# EAGLE design bandswitch (EAGLE 9.6.2)
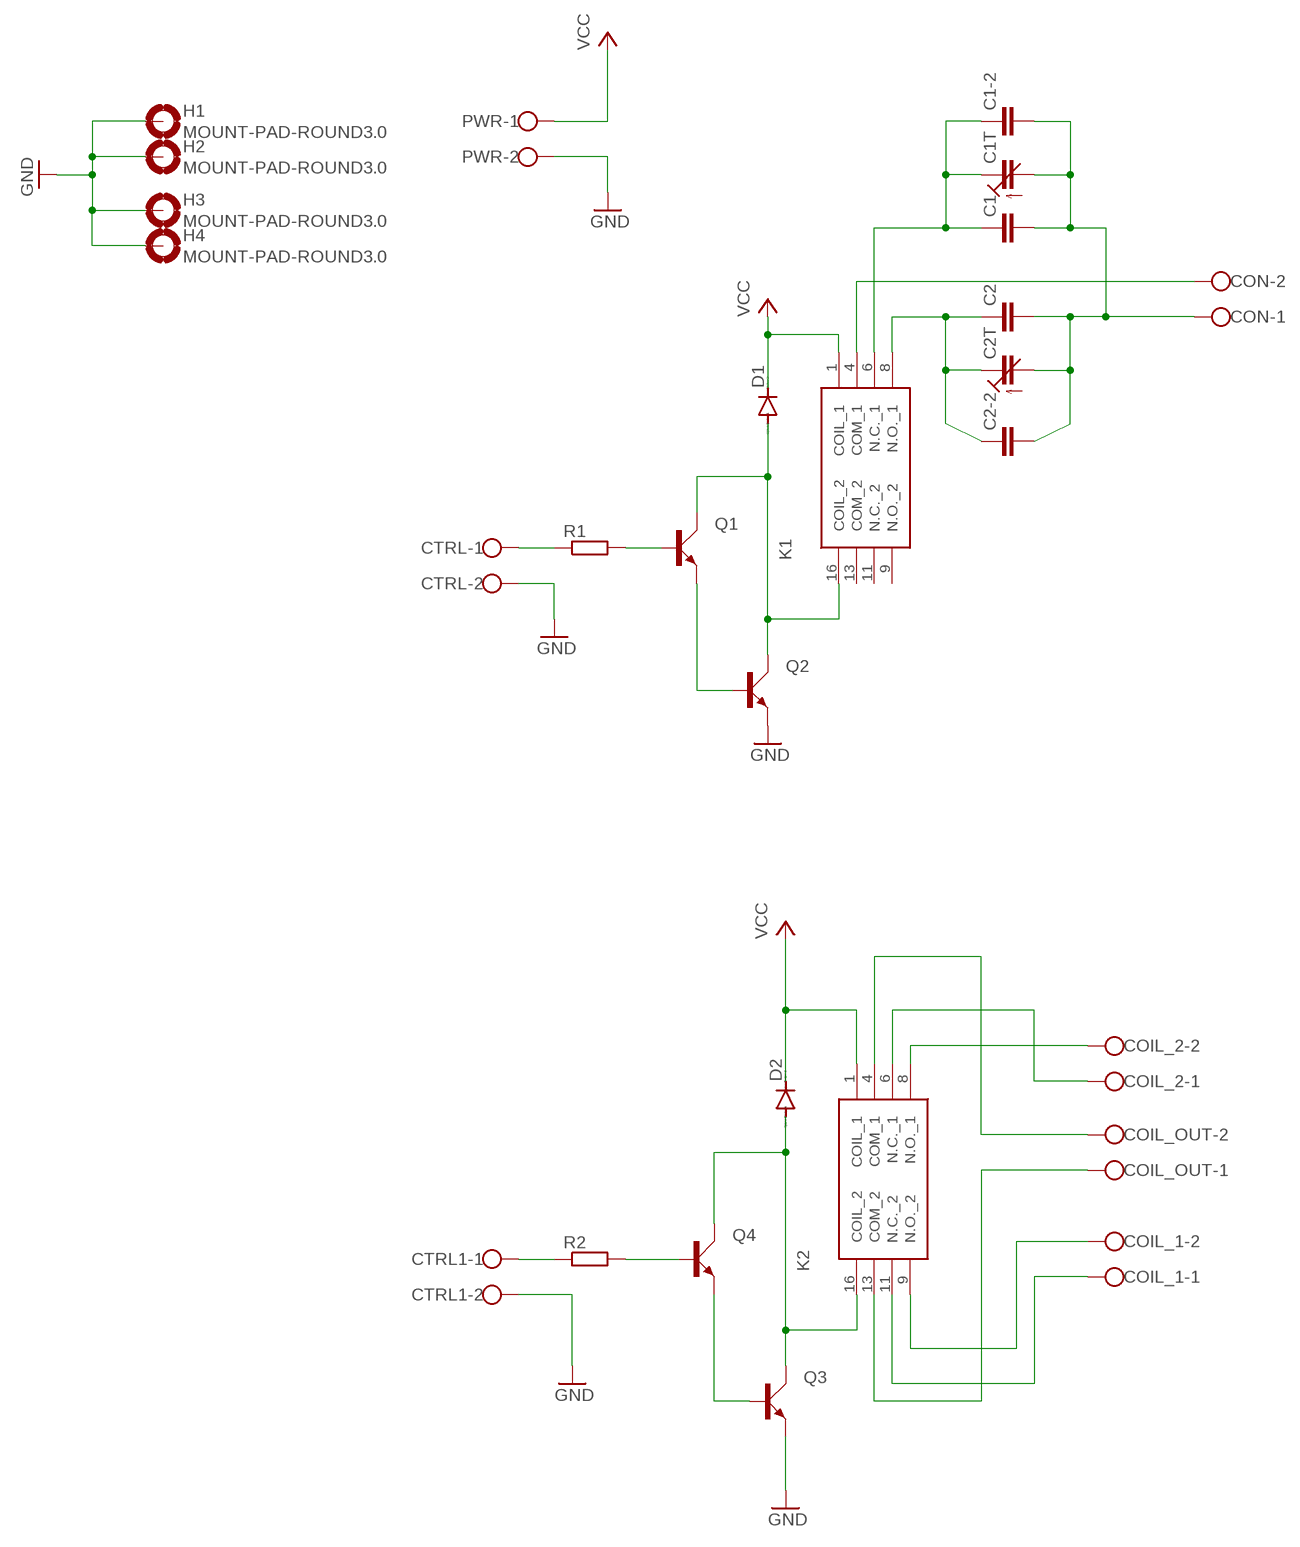
[diagram p0: schematic, sheet 1]

## Parts
C1  C_0805_PTH  [C0805K]
C1-2  C_0805_PTH  [C0805K]
C1T  C_TRIM_TH  [CTRIM3050.505]
C2  C_0805_PTH  [C0805K]
C2-2  C_0805_PTH  [C0805K]
C2T  C_TRIM_TH  [CTRIM3050.505]
COIL_1  W237-102  [W237-102]
COIL_2  W237-102  [W237-102]
COIL_OUT  W237-102  [W237-102]
CON  W237-102  [W237-102]
CTRL  W237-102  [W237-102]
CTRL1  W237-102  [W237-102]
D1  1N4148DO35-7  [DO35-7]
D2  1N4148DO35-7  [DO35-7]
H1  MOUNT-PAD-ROUND3.0  [3,0-PAD]
H2  MOUNT-PAD-ROUND3.0  [3,0-PAD]
H3  MOUNT-PAD-ROUND3.0  [3,0-PAD]
H4  MOUNT-PAD-ROUND3.0  [3,0-PAD]
K1  G5V-2-H1-DC5  [G5V2H1DC5]
K2  G5V-2-H1-DC5  [G5V2H1DC5]
PWR  W237-102  [W237-102]
Q1  BC547  [SOT54A]
Q2  BC547  [SOT54A]
Q3  BC547  [SOT54A]
Q4  BC547  [SOT54A]
R1  R_0805_PTH  [R0805]
R2  R_0805_PTH  [R0805]

## Nets
GND: CTRL1.2 CTRL.2 H1.B3,0(MOUNT) H2.B3,0(MOUNT) H3.B3,0(MOUNT) H4.B3,0(MOUNT) PWR.2 Q2.E Q3.E
N$1: Q1.E Q2.B
N$2: D1.A K1.16(COIL_2) Q1.C Q2.C
N$3: Q1.B R1.2 R1.P$2
N$4: CTRL.1 R1.1 R1.P$1
N$5: D2.A K2.16(COIL_2) Q3.C Q4.C
N$6: Q3.B Q4.E
N$7: Q4.B R2.2 R2.P$2
N$8: CTRL1.1 R2.1 R2.P$1
N$9: COIL_OUT.2 K2.4(COM_1)
N$10: C1-2.1 C1-2.P$1 C1.1 C1.P$1 C1T.2(E) K1.6(N.C._1)
N$11: C2-2.1 C2-2.P$1 C2.1 C2.P$1 C2T.2(E) K1.8(N.O._1)
N$12: C1-2.2 C1-2.P$2 C1.2 C1.P$2 C1T.1(A) C2-2.2 C2-2.P$2 C2.2 C2.P$2 C2T.1(A) CON.1
N$13: CON.2 K1.4(COM_1)
N$14: COIL_OUT.1 K2.13(COM_2)
N$15: COIL_1.1 K2.11(N.C._2)
N$16: COIL_2.1 K2.6(N.C._1)
N$17: COIL_2.2 K2.8(N.O._1)
N$18: COIL_1.2 K2.9(N.O._2)
VCC: D1.C D2.C K1.1(COIL_1) K2.1(COIL_1) PWR.1
Unconnected: K1.9(N.O._2) K1.11(N.C._2) K1.13(COM_2)

## Library data of the parts
C1 C1-2 C2 C2-2 = mylib:C_0805_PTH
C1T C2T = mylib:C_TRIM_TH
COIL_1 COIL_2 COIL_OUT CON CTRL CTRL1 PWR = con-wago-500:W237-102: WAGO SCREW CLAMP; MPN: 237-102; OC_FARNELL: unknown; OC_NEWARK: 70K9898
D1 D2 = diode:1N4148: DIODE high speed (Philips)
H1-H4 = holes:MOUNT-PAD-ROUND: MOUNTING PAD, round
K1 K2 = G5V-2-H1-DC5:G5V-2-H1-DC5: DPDT PCB Mount Non-Latching Relay Plug In, 1 A, 5V dc Source: Datasheet <http://uk.rs-online.com/web/p/products/8074535>; ARROW_PART_NUMBER: G5V-2-H1-DC5; ARROW_PRICE-STOCK: https://www.arrow.com/en/products/g5v-2-h1dc5/omron?region=nac; DESCRIPTION: DPDT PCB Mount Non-Latching Relay Plug In, 1 A, 5V dc; HEIGHT: 11.5mm; MANUFACTURER_NAME: Omron Electronics; MANUFACTURER_PART_NUMBER: G5V-2-H1-DC5; MOUSER_PART_NUMBER: 653-G5V-2-H1-DC5; MOUSER_PRICE-STOCK: https://www.mouser.co.uk/ProductDetail/Omron-Electronics/G5V-2-H1-DC5?qs=B3tblJ0Nlt9vPpFeBhhwGQ%3D%3D
Q1-Q4 = transistor-small-signal:BC547: NPN TRANSISTOR
R1 R2 = mylib:R_0805_PTH

## Board
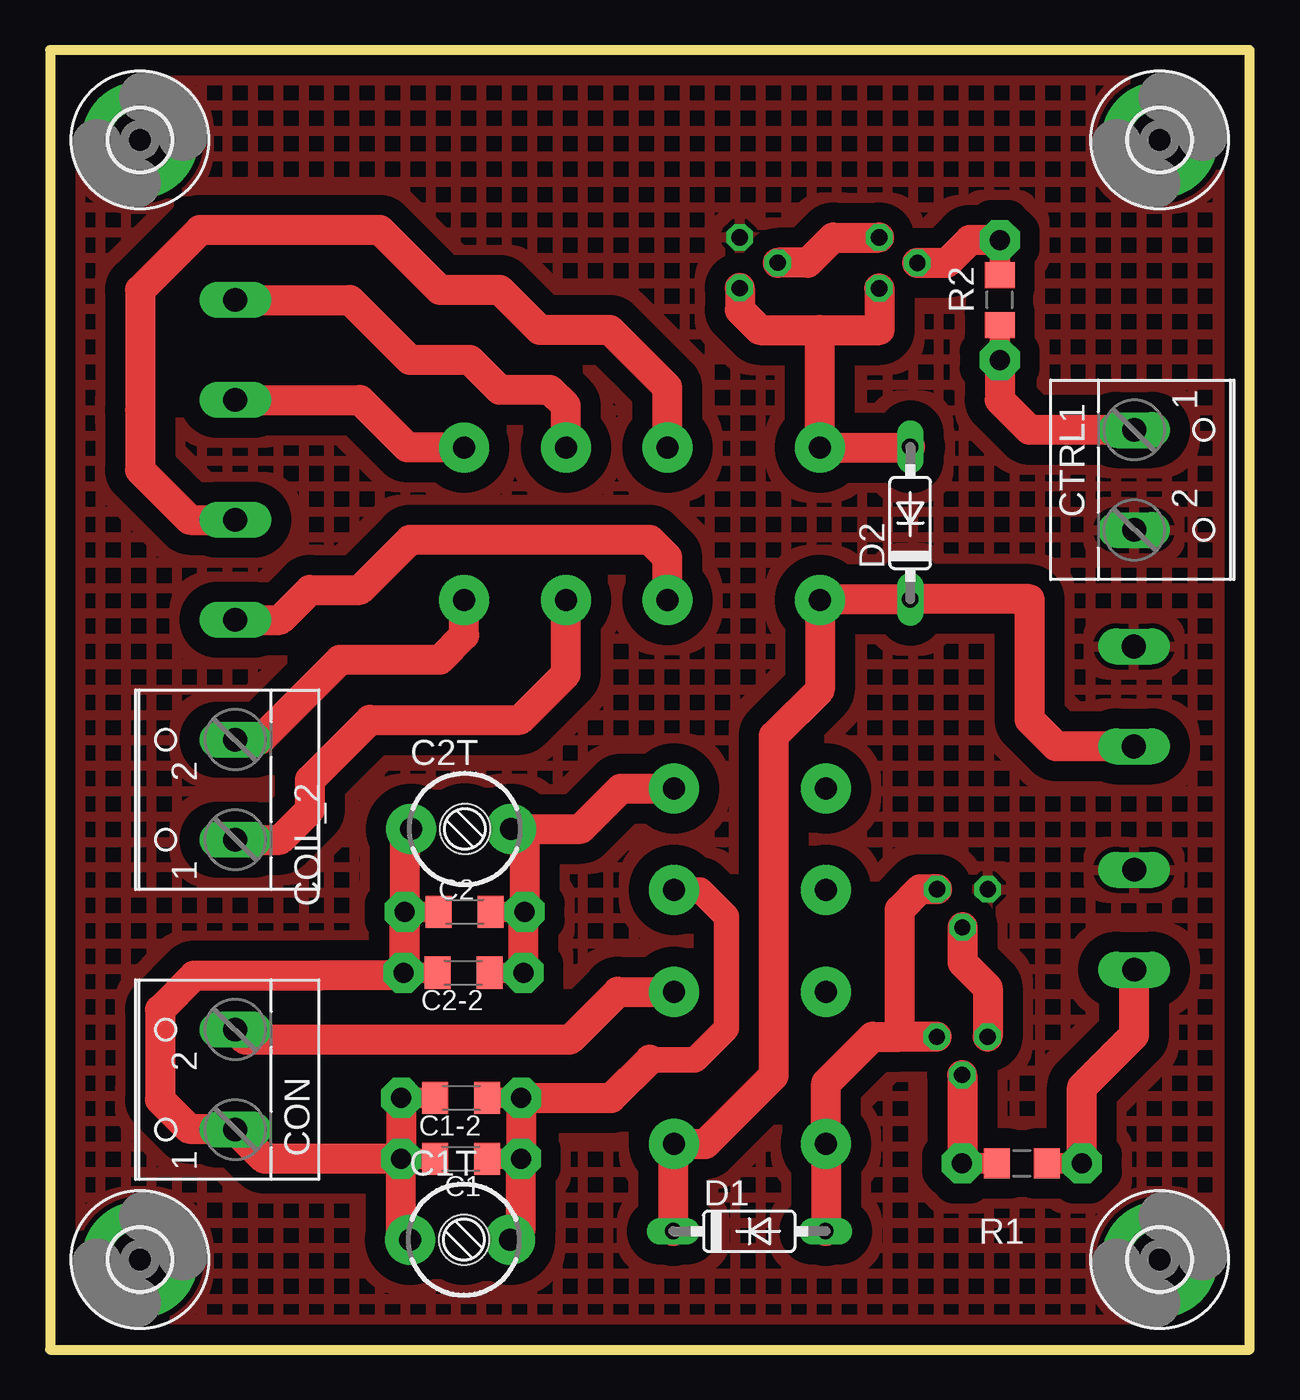
[diagram p1: board, top side]
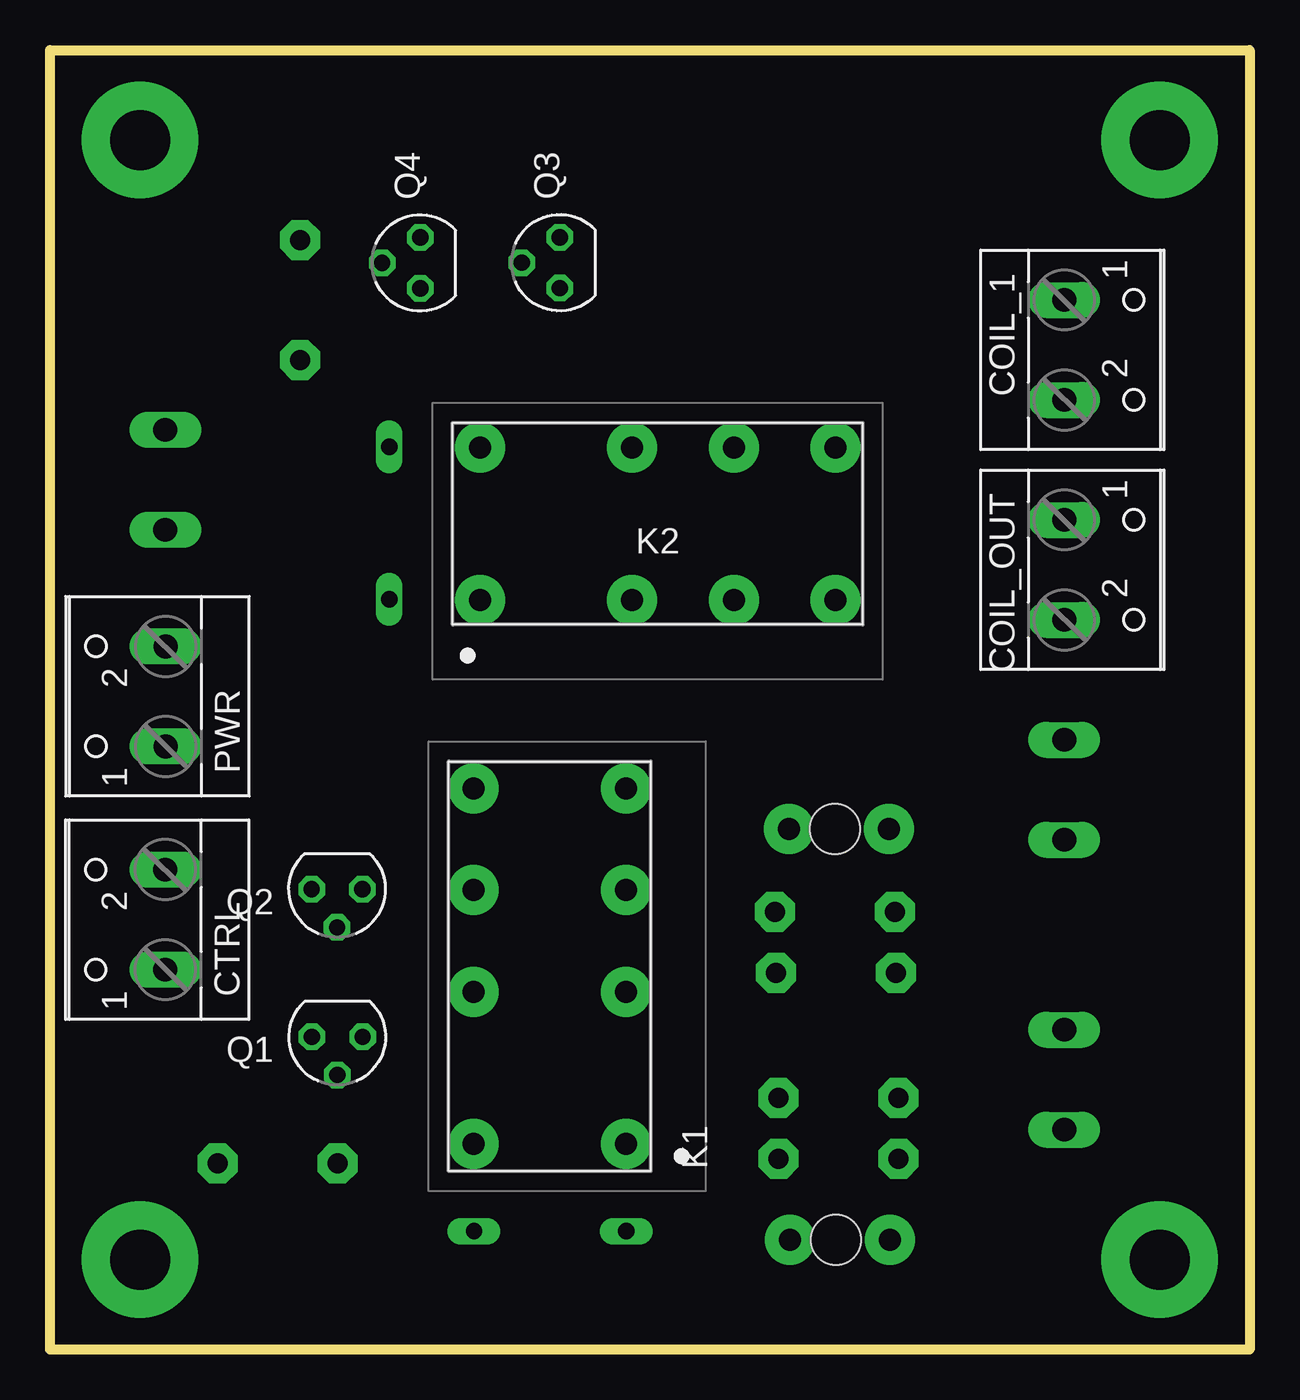
[diagram p2: board, bottom side, seen from below]

Size 60 x 65 mm. Coordinates in mm from the lower left corner, seen from the top.
Outline: 0,0 60,0 60,65 0,65 0,0
Copper layers (1*16): Top 0.035mm / dielectric 1.5mm / Bottom 0.035mm
Design rules "default": minimum track width 6mil, minimum drill 0.35mm, track to track 6mil, track to pad 6mil, pad to pad 6mil, via to via 6mil, smd to smd 6mil, copper to edge 40mil, drill to drill 6mil, minimum pad ring 10mil, minimum via ring 8mil, stop-mask expansion 4mil, vias tented up to drill 0mil, thermal gap 10mil

### Footprints (pad centres in the part's own frame; a part is rotated, then mirrored left to right if it is on the bottom)
C0805K = smd 1.3 x 1.6: 1 -1.3,0; 2 1.3,0 | drill 1 pad 2 octagon: P$1 -3,0; P$2 3,0
CTRIM3050.505 = drill 1.1 pad 2.5: 1 -2.5,0; 2 2.5,0 | hole 2.5: 0.2,0
W237-102 = drill 1.194 long: 1 -2.5,-1.27; 2 2.5,-1.27
DO35-7 = drill 0.813 long: A 3.81,0; C -3.81,0
3,0-PAD = drill 3 pad 5.842: B3,0 0,0
G5V2H1DC5 = drill 1.1 pad 2.5: 1 0,0; 4 7.62,0; 6 12.7,0; 8 17.78,0; 9 17.78,7.62; 11 12.7,7.62; 13 7.62,7.62; 16 0,7.62
SOT54A = drill 0.813 octagon: B 0,1.905; C -1.27,0; E 1.27,0
R0805 = smd 1.3 x 1.5: 1 -1.25,0; 2 1.25,0 | drill 1 pad 2 octagon: P$1 -3,0; P$2 3,0

### Placement (x,y rotation side)
C1  20.56,9.55 180 top
C1-2  20.57,12.58 180 top
C1T  20.5,5.5 0 top
C2  20.74,21.89 180 top
C2-2  20.68,18.85 180 top
C2T  20.55,26.04 0 top
COIL_1  8,50 270 bottom
COIL_2  8,28 90 top
COIL_OUT  8,39 270 bottom
CON  8,13.5 90 top
CTRL  55.5,21.5 90 bottom
CTRL1  55.5,43.5 270 top
D1  34.98,5.92 0 top
D2  43.03,41.34 90 top
H1  4.5,4.5 0 top
H2  55.5,4.5 0 top
H3  55.5,60.5 0 top
H4  4.5,60.5 0 top
K1  31.2,10.28 90 bottom
K2  38.5,37.5 0 bottom
PWR  55.49,32.67 90 bottom
Q1  45.63,15.64 180 bottom
Q2  45.64,23.02 180 bottom
Q3  34.5,54.36 90 bottom
Q4  41.48,54.35 90 bottom
R1  48.62,9.31 180 top
R2  47.5,52.5 90 top

### Tracks (layer width: path | path; a pad name or v marks a point on that pad's centre or on a via)
GND
  pour Top (isolate 1, hatched): -1,66.5 -1,-1.5 62.5,-1.5 62.5,66.5
N$1
  Top 1.5: Q2.B 45.64,19.36 46.9,18.1 Q1.E
N$2
  Top 1.5: Q2.C 43.52,23.02 42.5,22 42.5,15.64 | Q1.C 42.5,15.64 | 42.5,15.64 41.14,15.64 38.82,13.32 K1.16 38.82,5.95 D1.A
N$3
  Top 1.016: R1.P$2 R1.2
  Top 1.5: Q1.B R1.P$2
N$4
  Top 1.016: R1.1 R1.P$1
  Top 1.5: R1.P$1 51.62,13.12 54.23,15.73 CTRL.1
N$5
  Top 1.5: D2.A 43,45.12 K2.16 38.5,51 | Q4.C 41.5,53.06 41.5,51 38.5,51 | Q3.C 34.5,52 35.5,51 38.5,51
N$6
  Top 1.5: Q3.B 37.91,54.36 39.16,55.62 Q4.E
N$7
  Top 1.016: R2.2 R2.P$2
  Top 1.5: R2.P$2 46,55.5 44.85,54.35 Q4.B
N$8
  Top 1.016: R2.P$1 R2.1
  Top 1.5: CTRL1.1 49,46 47.5,47.5 R2.P$1
N$9
  Top 1.5: K2.4 30.88,39.62 30,40.5 18,40.5 15.5,38 13,38 11.5,36.5 COIL_OUT.2
N$10
  Top 1.016: C1.1 C1.P$1 | C1-2.1 C1-2.P$1
  Top 1.27: K1.6 32.52,22.98 33.84,21.66 33.84,16.07 32.27,14.5 30,14.5
  Top 1.5: C1T.2 23.56,6.06 C1.P$1 C1-2.P$1 28.08,12.58 30,14.5
N$11
  Top 1.016: C2.1 C2.P$1 | C2-2.1 C2-2.P$1
  Top 1.5: K1.8 28.56,28.06 26.54,26.04 C2T.2 23.74,25.35 C2.P$1 23.68,21.83 C2-2.P$1
N$12
  Top 1.016: C1.P$2 C1.2 | C2.P$2 C2.2 | C2-2.P$2 C2-2.2 | C1-2.P$2 C1-2.2
  Top 1.5: C1.P$2 10.72,9.55 CON.1 9.32,11.05 6.95,11.05 5.5,12.5 5.5,17 7.21,18.71 13.5,18.71 17.74,18.71 C2.P$2 | C1T.1 17.56,5.94 C1.P$2 | C2T.1 17.74,25.73 C2.P$2 | C2.P$2 17.74,18.91 C2-2.P$2 | C1-2.P$2 C1.P$2
N$13
  Top 1.5: K1.4 28.4,17.9 26,15.5 9.77,15.5 CON.2
N$14
  Top 1.5: K2.13 30.88,48.12 29,50 28,51 24.5,51 22.5,53 19.5,53 16.5,56 7.5,56 4.5,53 4.5,47 4.5,44 7,41.5 COIL_OUT.1
N$15
  Top 1.5: K2.11 25.8,47.2 25,48 22.5,48 21,49.5 18,49.5 15,52.5 COIL_1.1
N$16
  Top 1.5: COIL_2.1 11.5,25.5 13,27 13,28.5 16,31.5 23.5,31.5 25.8,33.8 K2.6
N$17
  Top 1.5: K2.8 20.72,35.72 19.5,34.5 14.5,34.5 10.5,30.5 COIL_2.2
N$18
  Top 1.5: K2.9 17.88,45.12 15.5,47.5 COIL_1.2
VCC
  Top 1.5: D1.C 31.17,10.25 K1.1 32.78,10.28 36.21,13.71 36.21,30.71 38.5,33 K2.1 38.53,37.53 D2.C 49,37.53 49,31.5 50.33,30.17 PWR.1